# EasyEDA Pro project 第十五届蓝桥杯EDA赛模拟试题一参考答案.eprj

# Schematic Schematic1
Create Date: 2023-12-29; Page Name: P1; Project Name: 题目二：基于CW32的简易游戏机; Schematic Name: Schematic1; Update Date: 2024-01-06; Company: 深圳嘉立创科技集团股份有限公司; Drawed: 嘉立创EDA; Page Size: A4; Part Number: JLC-PCB-002; Reviewed: 嘉立创EDA; Version: V1.0
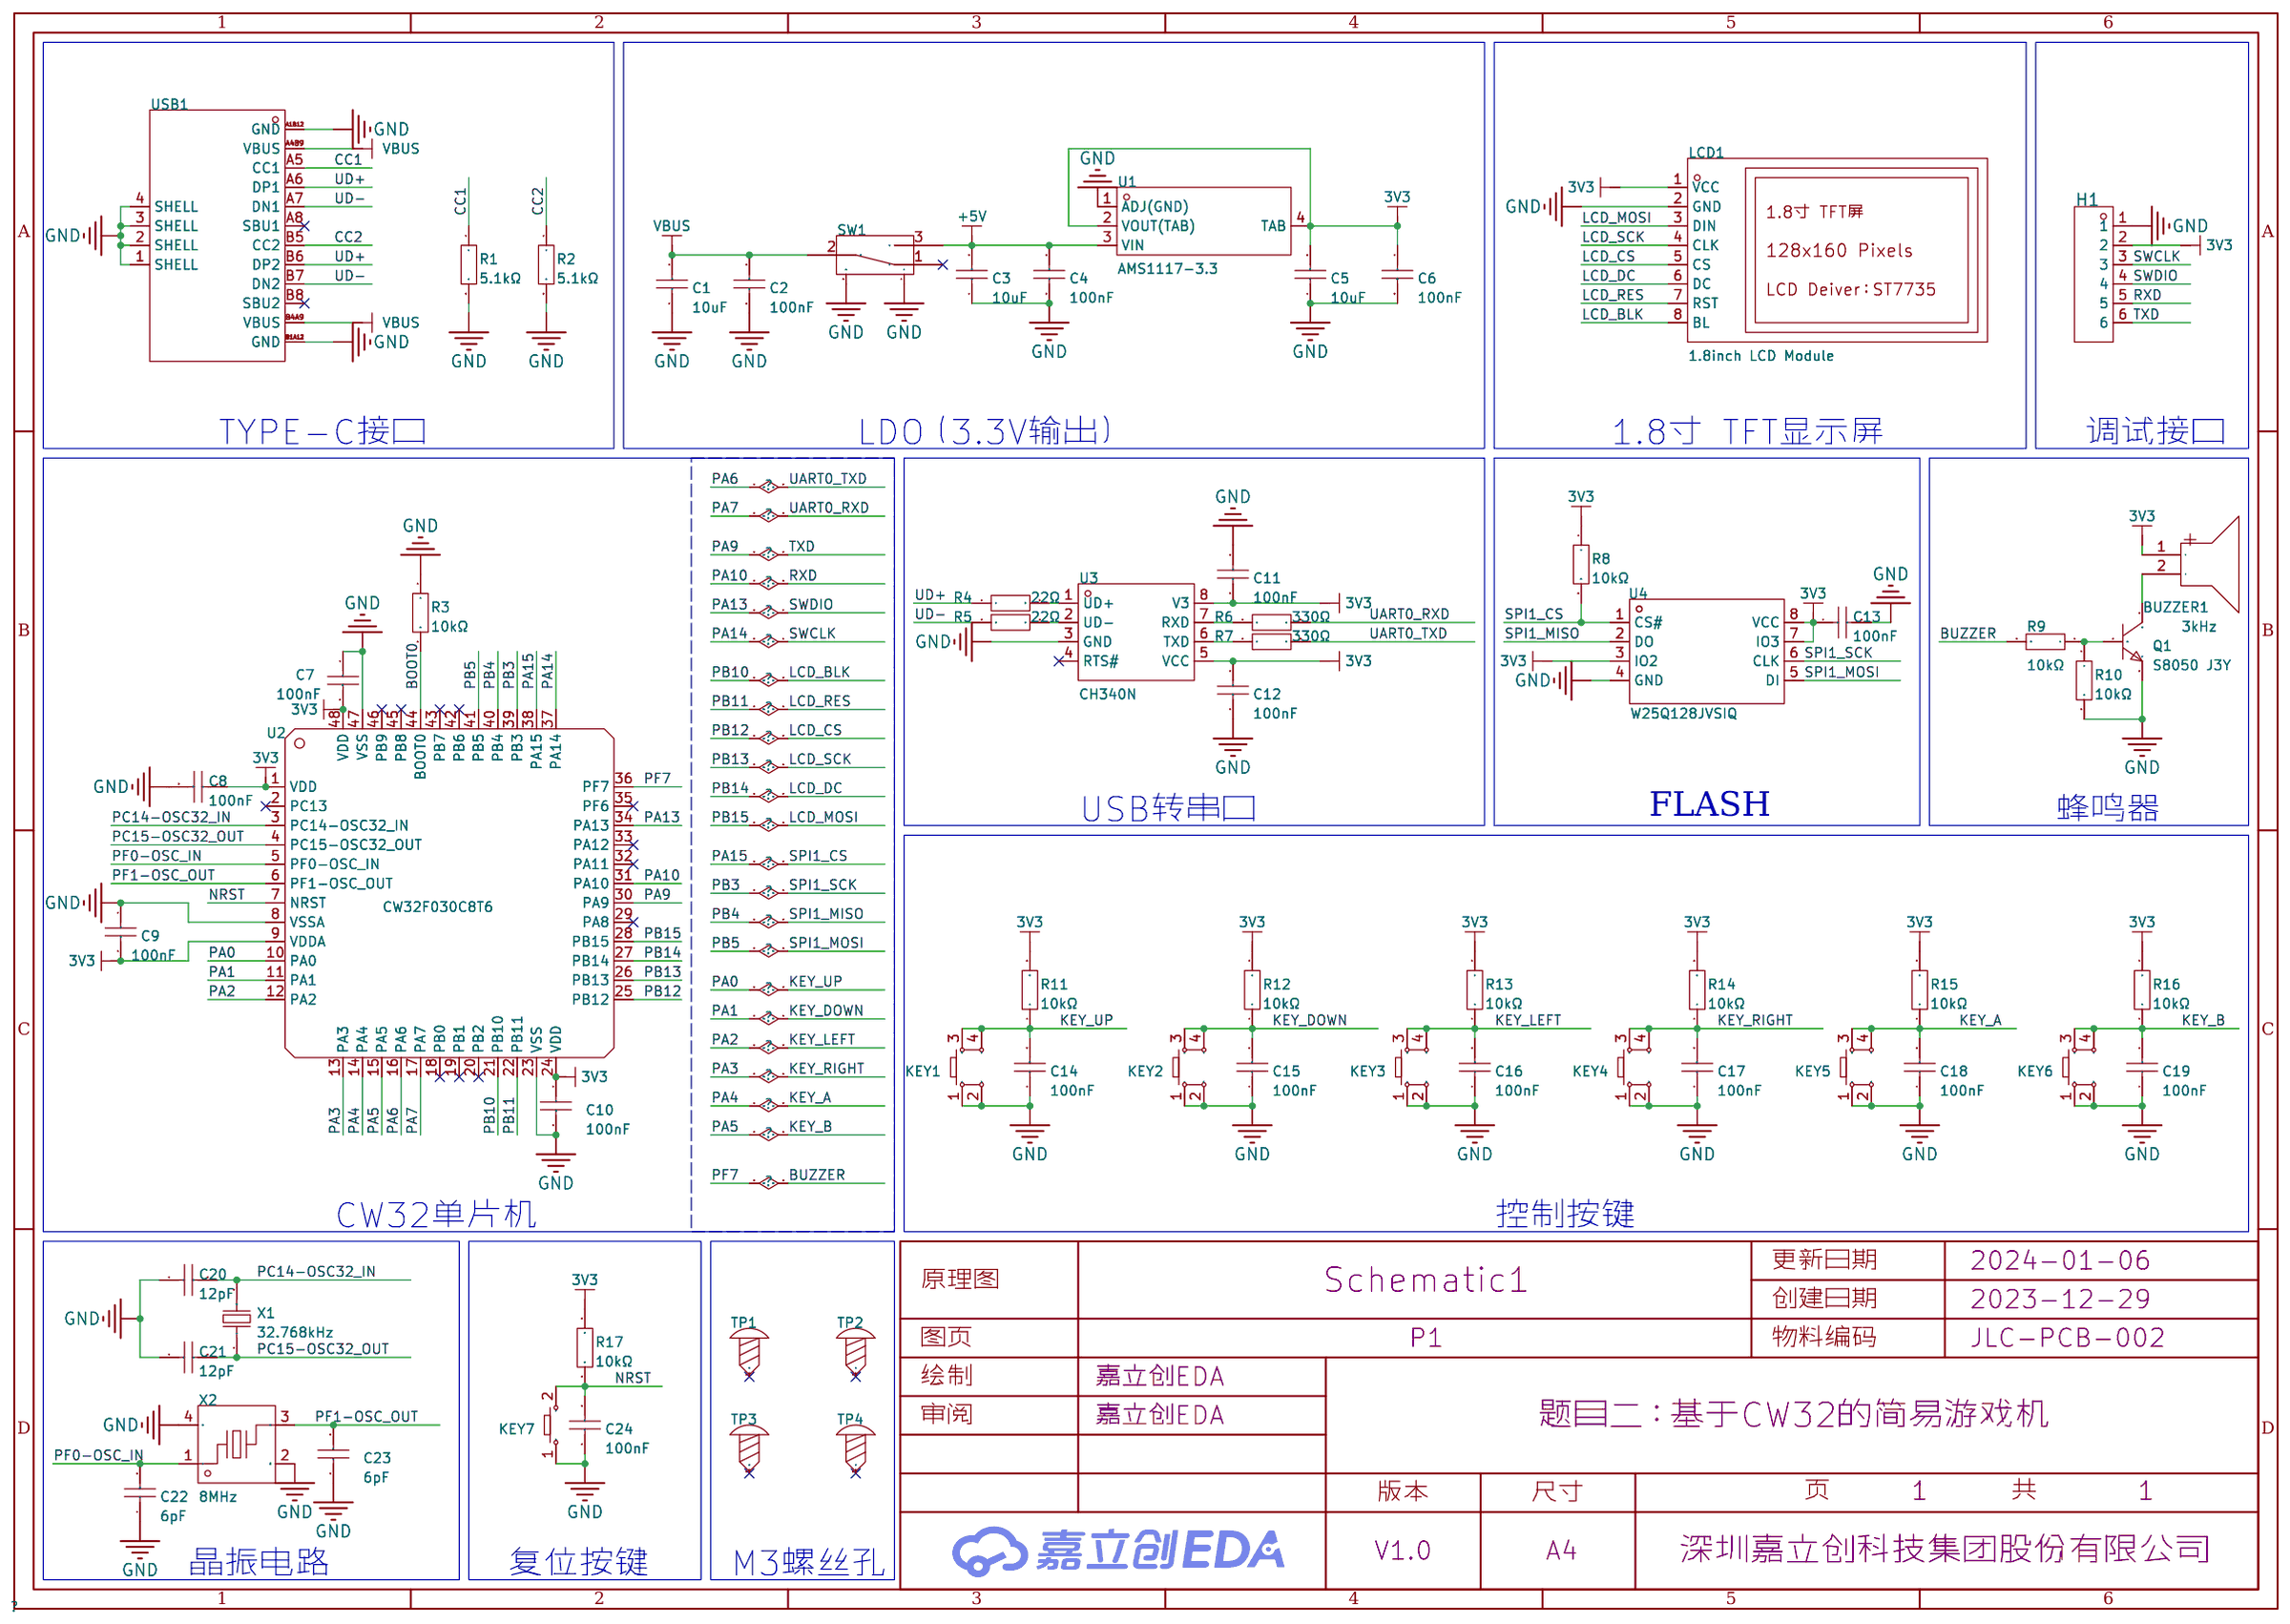
[diagram p0: schematic sheet]

## Parts
BUZZER1  3kHz  [BUZ-TH_BD9.0-P5.00-D0.6-FD]
C1  10uF  [C0805]
C2  100nF  [C0805]
C3  10uF  [C0805]
C4  100nF  [C0805]
C5  10uF  [C0805]
C6  100nF  [C0805]
C7  100nF  [C0805]
C8  100nF  [C0805]
C9  100nF  [C0805]
C10  100nF  [C0805]
C11  100nF  [C0805]
C12  100nF  [C0805]
C13  100nF  [C0805]
C14  100nF  [C0805]
C15  100nF  [C0805]
C16  100nF  [C0805]
C17  100nF  [C0805]
C18  100nF  [C0805]
C19  100nF  [C0805]
C20  12pF  [C0805]
C21  12pF  [C0805]
C22  6pF  [C0805]
C23  6pF  [C0805]
C24  100nF  [C0805]
H1  PZ254V-11-06P  [HDR-TH_6P-P2.54-V-M]
KEY1  -  [SW-SMD_4P-L6.0-W6.0-P4.50-LS9.0-2]
KEY2  -  [SW-SMD_4P-L6.0-W6.0-P4.50-LS9.0-2]
KEY3  -  [SW-SMD_4P-L6.0-W6.0-P4.50-LS9.0-2]
KEY4  -  [SW-SMD_4P-L6.0-W6.0-P4.50-LS9.0-2]
KEY5  -  [SW-SMD_4P-L6.0-W6.0-P4.50-LS9.0-2]
KEY6  -  [SW-SMD_4P-L6.0-W6.0-P4.50-LS9.0-2]
KEY7  -  [Key_SMD_3.6x6.1x2.5]
LCD1  1.8inch LCD Module  [LCD-TH_L56.5-W34.0_1-8INCH-LCD-MODULE]
Q1  S8050 J3Y  [SOT-23-3_L3.0-W1.7-P0.95-LS2.9-BR]
R1  5.1kΩ  [R0805]
R2  5.1kΩ  [R0805]
R3  10kΩ  [R0805]
R4  22Ω  [R0805]
R5  22Ω  [R0805]
R6  330Ω  [R0805]
R7  330Ω  [R0805]
R8  10kΩ  [R0805]
R9  10kΩ  [R0805]
R10  10kΩ  [R0805]
R11  10kΩ  [R0805]
R12  10kΩ  [R0805]
R13  10kΩ  [R0805]
R14  10kΩ  [R0805]
R15  10kΩ  [R0805]
R16  10kΩ  [R0805]
R17  10kΩ  [R0805]
SW1  SK-12E12-G5  [SW-TH_SK-12E12-G5]
TP1  -  [M3螺丝]
TP2  -  [M3螺丝]
TP3  -  [M3螺丝]
TP4  -  [M3螺丝]
U1  AMS1117-3.3  [SOT-223-4_L6.5-W3.5-P2.30-LS7.0-BR]
U2  CW32F030C8T6  [LQFP-48_L7.0-W7.0-P0.50-LS9.0-TL]
U3  CH340N  [SOP-8_L4.9-W3.9-P1.27-LS6.0-BL]
U4  W25Q128JVSIQ  [SOIC-8_L5.3-W5.3-P1.27-LS8.0-BL]
USB1  TYPE-C 16PIN 3MD(385)  [USB-C-SMD_TYPE-C16PIN]
X1  32.768kHz  [FC-135R_L3.2-W1.5]
X2  8MHz  [OSC-SMD_4P-L3.2-W2.5-BL]

## Library data of the parts
BUZZER1 = HNB09A03: 驱动方式:有源(内含驱动线路);构造类型:电磁式;额定电压:3V;工作电压:1.5V~4.5V;消耗电流:30mA;频率:3kHz;声压(SPL):85dB@10cm;直径(φD):9mm;长度:-;宽度:-;高度:5.5mm;工作温度:-20℃~+70℃;; LCSC Part Name: 电磁式有源一体蜂鸣器HNB09A03; Supplier Part: C96102; Manufacturer: 华能; Supplier Footprint: 插件,D=9mm; Datasheet: https://atta.szlcsc.com/upload/public/pdf/source/20170522/1495448326172.pdf; Supplier: LCSC; Oscillator Circuit: 有源(内含驱动线路); Technology Type: 电磁式; Rated Voltage: 3V; Operating Voltage: 1.5V~4.5V; Current Consumption: 30mA; Sound Pressure Level (SPL): 85dB@10cm; Diameter (φD): 9mm; Height: 5.5mm; Operating Temperature: -20℃~+70℃
C1 C3 C5 = CL21A106KAYNNNE_C15850: 容值:10uF;精度:±10%;额定电压:25V;材质(温度系数):X5R;; LCSC Part Name: 10uF ±10% 25V; Supplier Part: C15850; Manufacturer: SAMSUNG(三星); Manufacturer Part: CL21A106KAYNNNE; Supplier Footprint: 0805; Datasheet: https://atta.szlcsc.com/upload/public/pdf/source/20160103/1457707679302.pdf; Supplier: LCSC; Tolerance: ±10%; Voltage Rated: 25V; Temperature Coefficient: X5R
C2 C4 C6-C19 C24 = CL21B104KBCNNNC: 容值:100nF;精度:±10%;额定电压:50V;材质(温度系数):X7R;; LCSC Part Name: 100nF ±10% 50V; Supplier Part: C1711; Manufacturer: SAMSUNG(三星); Supplier Footprint: 0805; Datasheet: https://atta.szlcsc.com/upload/public/pdf/source/20160218/1457707763339.pdf; Supplier: LCSC; Tolerance: ±10%; Voltage Rated: 50V; Temperature Coefficient: X7R
C20 C21 = 0805CG120J500NT: 容值:12pF;精度:±5%;额定电压:50V;材质(温度系数):C0G;; LCSC Part Name: 12pF ±5% 50V; Supplier Part: C1792; Manufacturer: FH(风华); Supplier Footprint: 0805; Datasheet: https://atta.szlcsc.com/upload/public/pdf/source/20200305/C486355_26A10D38EF8C2A5C37091D0039909270.pdf; Supplier: LCSC; Tolerance: ±5%; Voltage Rated: 50V; Temperature Coefficient: C0G
C22 C23 = 0805CG6R0C500NT: 容值:6pF;额定电压:50V;材质(温度系数):C0G;; LCSC Part Name: 6pF 50V ±0.25pF; Supplier Part: C67560; Manufacturer: FH(风华); Supplier Footprint: 0805; JLCPCB Part Class: 扩展库; Datasheet: https://atta.szlcsc.com/upload/public/pdf/source/20200305/C486355_26A10D38EF8C2A5C37091D0039909270.pdf; Supplier: LCSC; Voltage Rated: 50V; Temperature Coefficient: C0G
H1 = PZ254V-11-06P: 排数:单排;总PIN位数:6;间距:2.54mm;插针结构:1x6P;行距:-;安装类型:直插;圆针/方针:方针;额定电流:-;额定电压:-;配合针长度:6mm;塑高:2.5mm;端接针长度:3mm;触头材质:黄铜;触头镀层:-;工作温度范围:-40℃~+105℃;颜色:黑色;; LCSC Part Name: 2.54mm 1x6P 直插 方针; Supplier Part: C492405; Manufacturer: XFCN(兴飞); Supplier Footprint: 直插,P=2.54mm; JLCPCB Part Class: 扩展库; Supplier: LCSC; Number of Rows: 单排; Number of Pins: 6; Pitch: 2.54mm; Pin Structure: 1x6P; Mounting Type: 直插; Circluar Pins/Square Pins: 方针; Length of Mating Pin: 6mm; Insulation Height: 2.5mm; Length of End Connection Pin: 3mm; Contact Material: 黄铜; Operating Temperature Range: -40℃~+105℃; Color: 黑色
KEY1-KEY6 = Key_SMD_6x6x6.5: Supplier Footprint: SMD
KEY7 = Key_SMD_3.6x6.1x2.5: Supplier Footprint: SMD
LCD1 = 1.8inch LCD Module: 主控芯片:ST7735S;尺寸(inch):1.8;; LCSC Part Name: 树莓派 1.8寸LCD 迷你显示屏 扩展板 SPI接口 支持Arduino; Supplier Part: C359940; Manufacturer: Waveshare(微雪电子); Datasheet: https://atta.szlcsc.com/upload/public/pdf/source/20190107/C359940_B08D95A5D16FFF3D67403C4EC320696B.pdf; Supplier: LCSC; Main Control Chip: ST7735S; Size: 1.8
Q1 = S8050 J3Y_C2146: 晶体管类型:NPN;集射极击穿电压(Vceo):25V;集电极电流(Ic):500mA;功率(Pd):300mW;直流电流增益(hFE@Ic,Vce):200@50mA,1V;; LCSC Part Name: NPN 25V 500mA (200-350); Supplier Part: C2146; Manufacturer: CJ(江苏长电/长晶); Supplier Footprint: SOT-23; Datasheet: https://atta.szlcsc.com/upload/public/pdf/source/20140809/1457707209234.pdf; Supplier: LCSC; Transistor Type: NPN; Collector-Emitter Breakdown Voltage (Vceo): 25V; Collector Current (Ic): 500mA; Power Dissipation (Pd): 300mW; Collector Cut-Off Current (Icbo): 100nA; Collector-Emitter Saturation Voltage (VCE(sat)@Ic,Ib): 600mV@500mA,50mA; DC Current Gain (hFE@Ic,Vce): 200@50mA,1V; Transition Frequency (fT): 150MHz; Operating Temperature: +150℃@(Tj)
R1 R2 = 0805W8F5101T5E: 阻值:5.1kΩ;精度:±1%;功率:125mW;温度系数:±100ppm/℃;电阻类型:厚膜电阻;; LCSC Part Name: 5.1kΩ ±1% 125mW 厚膜电阻; Supplier Part: C27834; Manufacturer: UNI-ROYAL(厚声); Supplier Footprint: 0805; JLCPCB Part Class: 基础库; Datasheet: https://atta.szlcsc.com/upload/public/pdf/source/20200306/C422600_1E6D84923E4A46A82E41ADD87F860B5C.pdf; Supplier: LCSC; Tolerance: ±1%; Power(Watts): 125mW; Overload Voltage (Max): 150V; Temperature Coefficient: ±100ppm/℃; Type: 厚膜电阻; Operating Temperature Range: -55℃~+155℃
R3 R8-R17 = 0805W8F1002T5E_C17414: 阻值:10kΩ;精度:±1%;功率:125mW;温度系数:±100ppm/℃;电阻类型:厚膜电阻;; LCSC Part Name: 10kΩ ±1% 125mW 厚膜电阻; Supplier Part: C17414; Manufacturer: UNI-ROYAL(厚声); Manufacturer Part: 0805W8F1002T5E; Supplier Footprint: 0805; Datasheet: https://atta.szlcsc.com/upload/public/pdf/source/20200306/C422600_1E6D84923E4A46A82E41ADD87F860B5C.pdf; Supplier: LCSC; Tolerance: ±1%; Power(Watts): 125mW; Overload Voltage (Max): 150V; Temperature Coefficient: ±100ppm/℃; Type: 厚膜电阻; Operating Temperature Range: -55℃~+155℃
R4 R5 = 0805W8F220JT5E: 阻值:22Ω;精度:±1%;功率:125mW;温度系数:±100ppm/℃;电阻类型:厚膜电阻;; LCSC Part Name: 22Ω ±1% 125mW 厚膜电阻; Supplier Part: C17561; Manufacturer: UNI-ROYAL(厚声); Supplier Footprint: 0805; JLCPCB Part Class: 基础库; Datasheet: https://atta.szlcsc.com/upload/public/pdf/source/20200306/C422600_1E6D84923E4A46A82E41ADD87F860B5C.pdf; Supplier: LCSC; Tolerance: ±1%; Power(Watts): 125mW; Overload Voltage (Max): 150V; Temperature Coefficient: ±100ppm/℃; Type: 厚膜电阻; Operating Temperature Range: -55℃~+155℃
R6 R7 = 0805W8F3300T5E: 阻值:330Ω;精度:±1%;功率:125mW;温度系数:±100ppm/℃;电阻类型:厚膜电阻;; LCSC Part Name: 330Ω ±1% 125mW 厚膜电阻; Supplier Part: C17630; Manufacturer: UNI-ROYAL(厚声); Supplier Footprint: 0805; JLCPCB Part Class: 基础库; Datasheet: https://atta.szlcsc.com/upload/public/pdf/source/20200306/C422600_1E6D84923E4A46A82E41ADD87F860B5C.pdf; Supplier: LCSC; Tolerance: ±1%; Power(Watts): 125mW; Overload Voltage (Max): 150V; Temperature Coefficient: ±100ppm/℃; Type: 厚膜电阻; Operating Temperature Range: -55℃~+155℃
SW1 = SK-12E12-G5: 额定电流(DC):-;额定电压(DC):-;额定电流(AC):-;额定电压(AC):-;电路结构:单刀双掷;安装方式:卧插;机械寿命:5千次;; LCSC Part Name: 卧插双档 滑动开关; Supplier Part: C136720; Manufacturer: 韩国韩荣; Supplier Footprint: 插件; JLCPCB Part Class: 扩展库; Datasheet: https://atta.szlcsc.com/upload/public/pdf/source/20210810/880D64C2F8CCE477762EFCC00B7B7681.pdf; Supplier: LCSC; Circuit: 单刀双掷; Mounting Style: 卧插; Mechanical Life: 5千次; Actuator Style: 矩形柱状; Pin Style: PC引脚; Operating Temperature: -25℃~+70℃; Switch Height: 10.6mm
TP1-TP4 = M3螺丝: Supplier Footprint: 插件
U1 = AMS1117-3.3_C347222: 输出类型:固定;最大输入电压:18V;输出电压:3.3V;输出电流:1A;电源纹波抑制比(PSRR):60dB@(120Hz);输出极性:正;; LCSC Part Name: 输入18V 输出3.3V 1A; Supplier Part: C347222; Manufacturer: UMW(友台半导体); Supplier Footprint: SOT-223; JLCPCB Part Class: 扩展库; Datasheet: https://atta.szlcsc.com/upload/public/pdf/source/20231109/155D79A26D9DB04352555A58D5969DC8.pdf; Supplier: LCSC; Output Type: 固定; Maximum Input Voltage: 18V; Output Voltage: 3.3V; Output Current: 1A; Power Supply Rejection Ratio (PSRR): 60dB@(120Hz); Dropout Voltage: 1.3V@(1A); Output Polarity: 正; Number of Outputs: 1
U2 = CW32F030C8T6_C3019113: CPU内核:ARM-M系列;CPU最大主频:64MHz;程序存储容量:-;程序存储器类型:-;GPIO端口数量:39;工作电压范围:1.65V~5.5V;RAM总容量:8KB;; Supplier Part: C3019113; Manufacturer: CW(芯源); Supplier Footprint: LQFP-48(7x7); Datasheet: https://atta.szlcsc.com/upload/public/pdf/source/20220516/D60F5E1023A73FFF550D4A77416DDFBC.pdf; Supplier: LCSC; CPU Core: ARM-M系列; CPU Maximum Speed: 64MHz; GPIO Ports Number: 39; Operating Voltage Range: 1.65V~5.5V; RAM Size: 8KB; Operating Temperature Range: -40℃~+105℃; ADC (Bit): 12bit; 16Bit Timer: 8; UART/USART: 3; I2C: 2; SPI: 2; Internal Comparator: 有; Peripheral/Function: 片载温度传感器；DMA；看门狗；低电压检测；CRC校验; Watchdog: 有; Low-Voltage Detect: 有; Direct Memory Access: 有
U3 = CH340N: LCSC Part Name: USB转串口芯片 CH340; Supplier Part: C2977777; Manufacturer: WCH(南京沁恒); Supplier Footprint: SOP-8; JLCPCB Part Class: 扩展库; Datasheet: https://atta.szlcsc.com/upload/public/pdf/source/20230530/6E401E9554E9F5311886CC8B3F89B62E.pdf; Supplier: LCSC
U4 = W25Q128JVSIQ: 接口类型:-;存储容量:128Mbit;时钟频率(fc):-;; LCSC Part Name: W25Q128JVSIQ 编带; Supplier Part: C97521; Manufacturer: WINBOND(华邦); Supplier Footprint: SOP-8-208mil; JLCPCB Part Class: 基础库; Datasheet: https://atta.szlcsc.com/upload/public/pdf/source/20170316/1489627409956.pdf; Supplier: LCSC; Memory Size: 128Mbit
USB1 = TYPE-C 16PIN 3MD(385): 连接器类型:Type-C;标准:-;公母:母;端口数量:1;触点数量:16P;安装方式:卧贴;额定电流 - 电源:3A;工作温度范围:-40℃~+85℃;; LCSC Part Name: Type-C 母 卧贴; Supplier Part: C2858270; Manufacturer: SHOU HAN(首韩); Supplier Footprint: SMD; JLCPCB Part Class: Extended Part; Datasheet: https://atta.szlcsc.com/upload/public/pdf/source/20211123/39B17C16241EAC15C5E277BDA434118E.pdf; Supplier: LCSC; Connector Type: Type-C; Gender: 母; Number of Ports: 1; Number of Contacts: 16P; Mounting Style: 卧贴; Current Rating - Power (Max): 3A; Operating Temperature Range: -40℃~+85℃
X1 = Q13FC1350000400: 频率:32.768kHz;负载电容:12.5pF;频率公差:±20ppm;; LCSC Part Name: 32.768kHz ±20ppm 12.5pF; Supplier Part: C32346; Manufacturer: EPSON(爱普生); Supplier Footprint: SMD3215-2P; Datasheet: https://atta.szlcsc.com/upload/public/pdf/source/20190108/C32346_746D6B07EAF90824457A96480007685F.pdf; Supplier: LCSC; Crystal Type: 贴片无源晶振; Load Capacitance: 12.5pF; Equivalent Series Resistance (ESR): 70kΩ; Frequency Tolerance: ±20ppm; Operating Temperature: -40℃~+85℃
X2 = X32258MOB4SI: 晶振类型:贴片无源晶振;频率:8MHz;常温频差:±10ppm;负载电容:12pF;频率稳定度(全温):±30ppm;; LCSC Part Name: 8MHz ±10ppm 12pF; Supplier Part: C2682775; Manufacturer: YXC(扬兴晶振); Supplier Footprint: SMD3225-4P; JLCPCB Part Class: 扩展库; Datasheet: https://atta.szlcsc.com/upload/public/pdf/source/20210106/C2682774_0CD4FDA5D9DA3FBEEC23BD607A48E4B0.pdf; Supplier: LCSC; Crystal Type: 贴片无源晶振; Normal temperature Frequency Tolerance: ±10ppm; Load Capacitance: 12pF; Frequency Stability(Full temperature range): ±30ppm; Equivalent Series Resistance (ESR): 150Ω; Operating Temperature: -40℃~+85℃

## Nets
3V3: BUZZER1.1(+) C5.2 C6.1 C7.2 C8.1 C9.2 C10.1 C11.2 C12.1 C13.1 H1.2 LCD1.1(VCC) R8.1 R11.2 R12.2 R13.2 R14.2 R15.2 R16.2 R17.2 U1.2(VOUT(TAB)) U1.4(TAB) U2.1(VDD) U2.9(VDDA) U2.24(VDD) U2.48(VDD) U3.5(VCC) U3.8(V3) U4.3(IO2) U4.7(IO3) U4.8(VCC)
+5V: C3.2 C4.1 SW1.3 U1.3(VIN)
GND: C1.1 C2.2 C3.1 C4.2 C5.1 C6.2 C7.1 C8.2 C9.1 C10.2 C11.1 C12.2 C13.2 C14.1 C15.1 C16.1 C17.1 C18.1 C19.1 C20.1 C21.1 C22.1 C23.1 C24.1 H1.1 KEY1.1 KEY1.2 KEY2.1 KEY2.2 KEY3.1 KEY3.2 KEY4.1 KEY4.2 KEY5.1 KEY5.2 KEY6.1 KEY6.2 KEY7.1 LCD1.2(GND) Q1.2(E) R1.2 R2.2 R3.1 R10.2 SW1.4 SW1.5 U1.1(ADJ(GND)) U2.8(VSSA) U2.23(VSS) U2.47(VSS) U3.3(GND) U4.4(GND) USB1.1(SHELL) USB1.2(SHELL) USB1.3(SHELL) USB1.4(SHELL) USB1.A1B12(GND) USB1.B1A12(GND) X2.2(GND) X2.4(GND)
VBUS: C1.2 C2.1 SW1.2 USB1.A4B9(VBUS) USB1.B4A9(VBUS)
BOOT0: R3.2 U2.44(BOOT0)
BUZZER: R9.2 U2.36(PF7)
CC1: R1.1 USB1.A5(CC1)
CC2: R2.1 USB1.B5(CC2)
KEY_A: C18.2 KEY5.3 KEY5.4 R15.1 U2.14(PA4)
KEY_B: C19.2 KEY6.3 KEY6.4 R16.1 U2.15(PA5)
KEY_DOWN: C15.2 KEY2.3 KEY2.4 R12.1 U2.11(PA1)
KEY_LEFT: C16.2 KEY3.3 KEY3.4 R13.1 U2.12(PA2)
KEY_RIGHT: C17.2 KEY4.3 KEY4.4 R14.1 U2.13(PA3)
KEY_UP: C14.2 KEY1.3 KEY1.4 R11.1 U2.10(PA0)
LCD_BLK: LCD1.8(BL) U2.21(PB10)
LCD_CS: LCD1.5(CS) U2.25(PB12)
LCD_DC: LCD1.6(DC) U2.27(PB14)
LCD_MOSI: LCD1.3(DIN) U2.28(PB15)
LCD_RES: LCD1.7(RST) U2.22(PB11)
LCD_SCK: LCD1.4(CLK) U2.26(PB13)
NRST: C24.2 KEY7.2 R17.1 U2.7(NRST)
PA6: R7.2 U2.16(PA6)
PA7: R6.2 U2.17(PA7)
PA9: H1.6 U2.30(PA9)
PA10: H1.5 U2.31(PA10)
PA13: H1.4 U2.34(PA13)
PA14: H1.3 U2.37(PA14)
PA15: R8.2 U2.38(PA15) U4.1(CS#)
PB3: U2.39(PB3) U4.6(CLK)
PB4: U2.40(PB4) U4.2(DO)
PB5: U2.41(PB5) U4.5(DI)
PC14-OSC32_IN: C20.2 U2.3(PC14-OSC32_IN) X1.2
PC15-OSC32_OUT: C21.2 U2.4(PC15-OSC32_OUT) X1.1
PF0-OSC_IN: C22.2 U2.5(PF0-OSC_IN) X2.1
PF1-OSC_OUT: C23.2 U2.6(PF1-OSC_OUT) X2.3
UD+: R4.1 USB1.A6(DP1) USB1.B6(DP2)
UD-: R5.1 USB1.A7(DN1) USB1.B7(DN2)
$1N8057: Q1.1(B) R9.1 R10.1
$1N8058: BUZZER1.2(-) Q1.3(C)
$1N15380: R4.2 U3.1(UD+)
$1N15383: R5.2 U3.2(UD-)
$1N15386: R6.1 U3.7(RXD)
$1N15389: R7.1 U3.6(TXD)

Not connected (* = marked no-connect by the designer): SW1 1*; TP1 1*; TP2 1*; TP3 1*; TP4 1*; U2 2(PC13)* 18(PB0)* 19(PB1)* 20(PB2)* 29(PA8)* 32(PA11)* 33(PA12)* 35(PF6)* 42(PB6)* 43(PB7)* 45(PB8)* 46(PB9)*; U3 4(RTS#)*; USB1 A8(SBU1)* B8(SBU2)*

## Notes on the sheet
- TYPE-C接口
- LDO（3.3V输出）
- 1.8寸 TFT显示屏
- 调试接口
- USB转串口
- FLASH
- 蜂鸣器
- CW32单片机
- 控制按键
- 晶振电路
- 复位按键
- M3螺丝孔

# Board PCB1
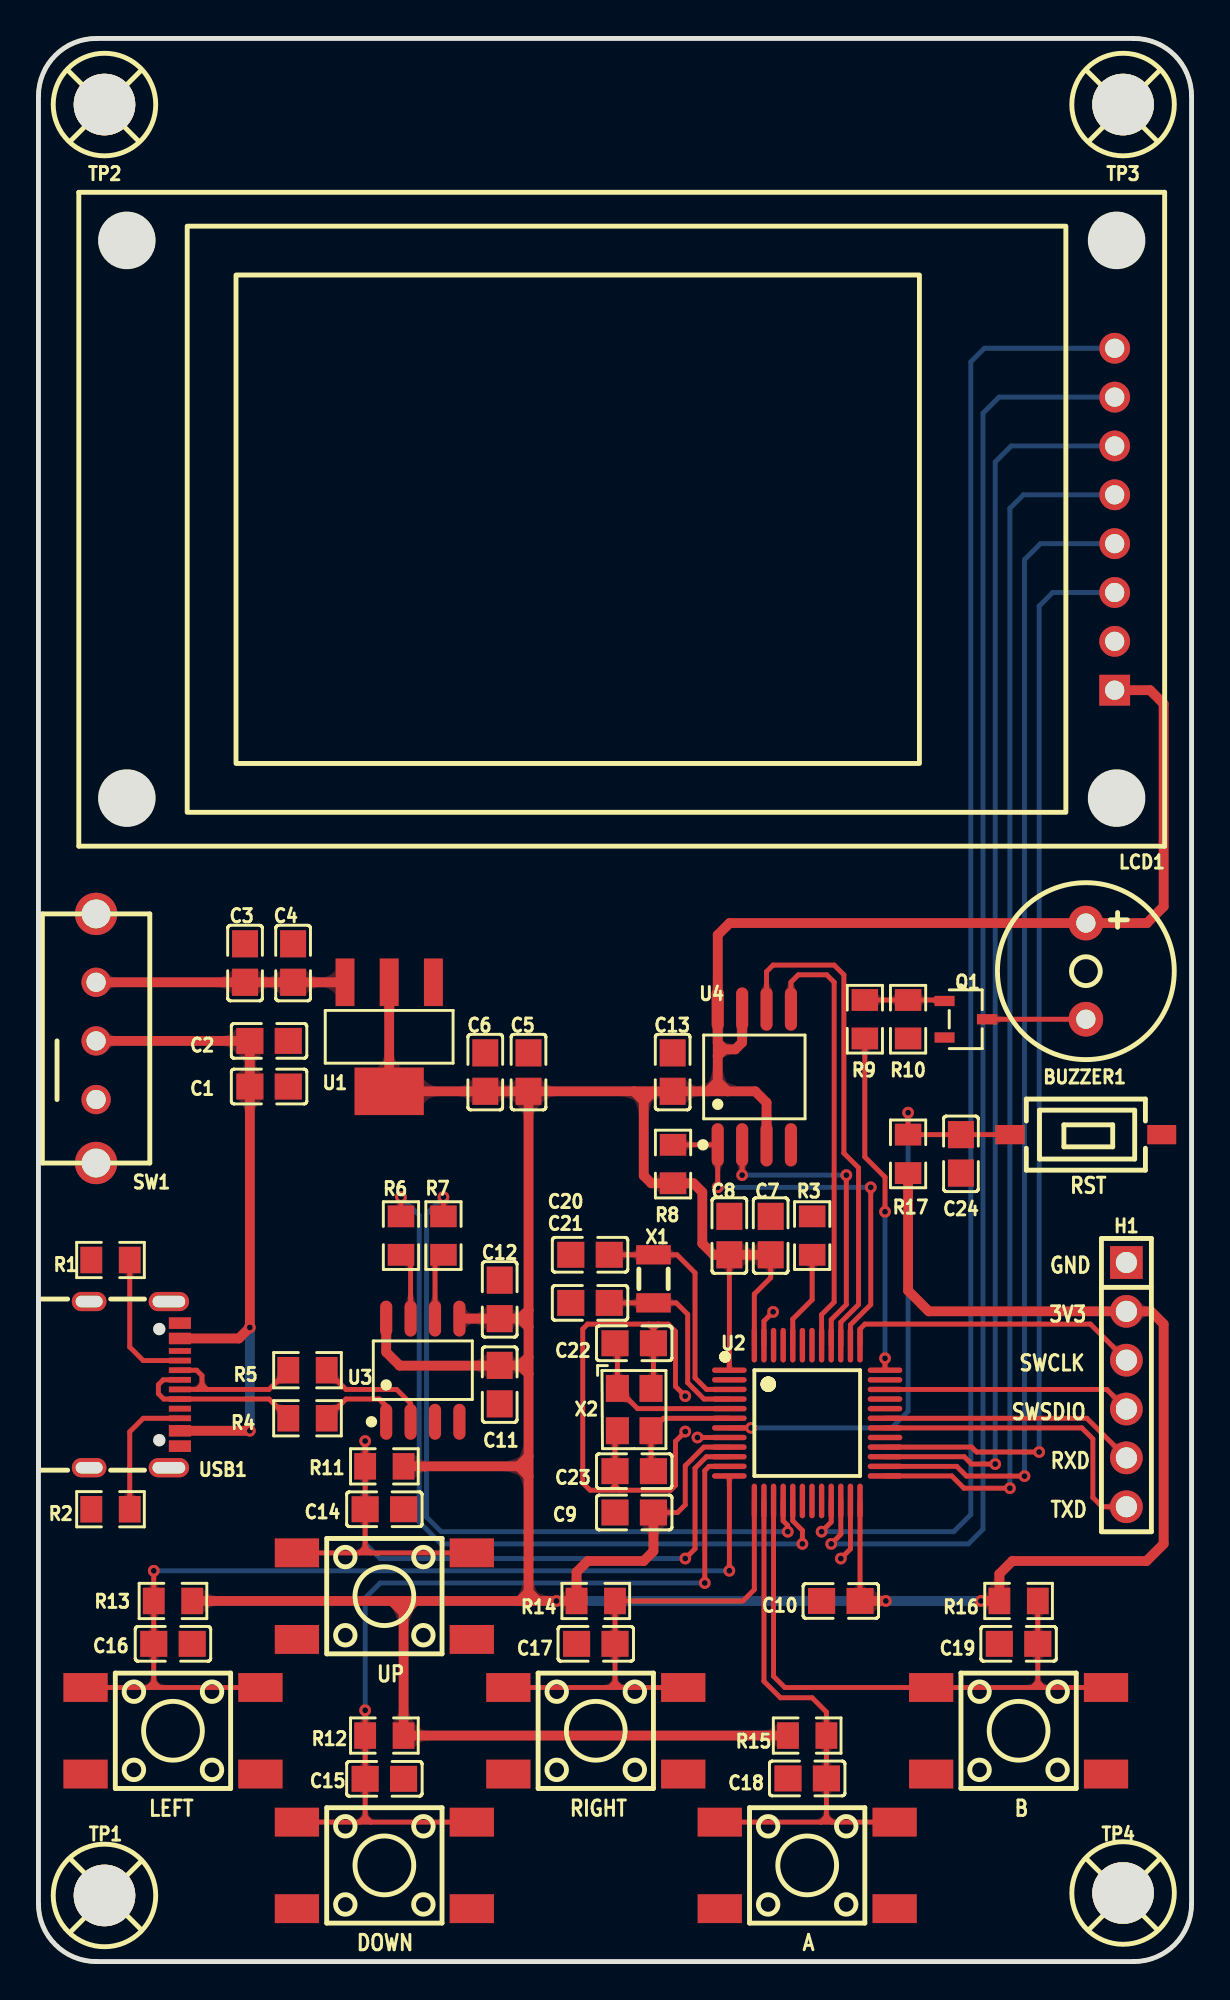
[diagram p1: board, top side]
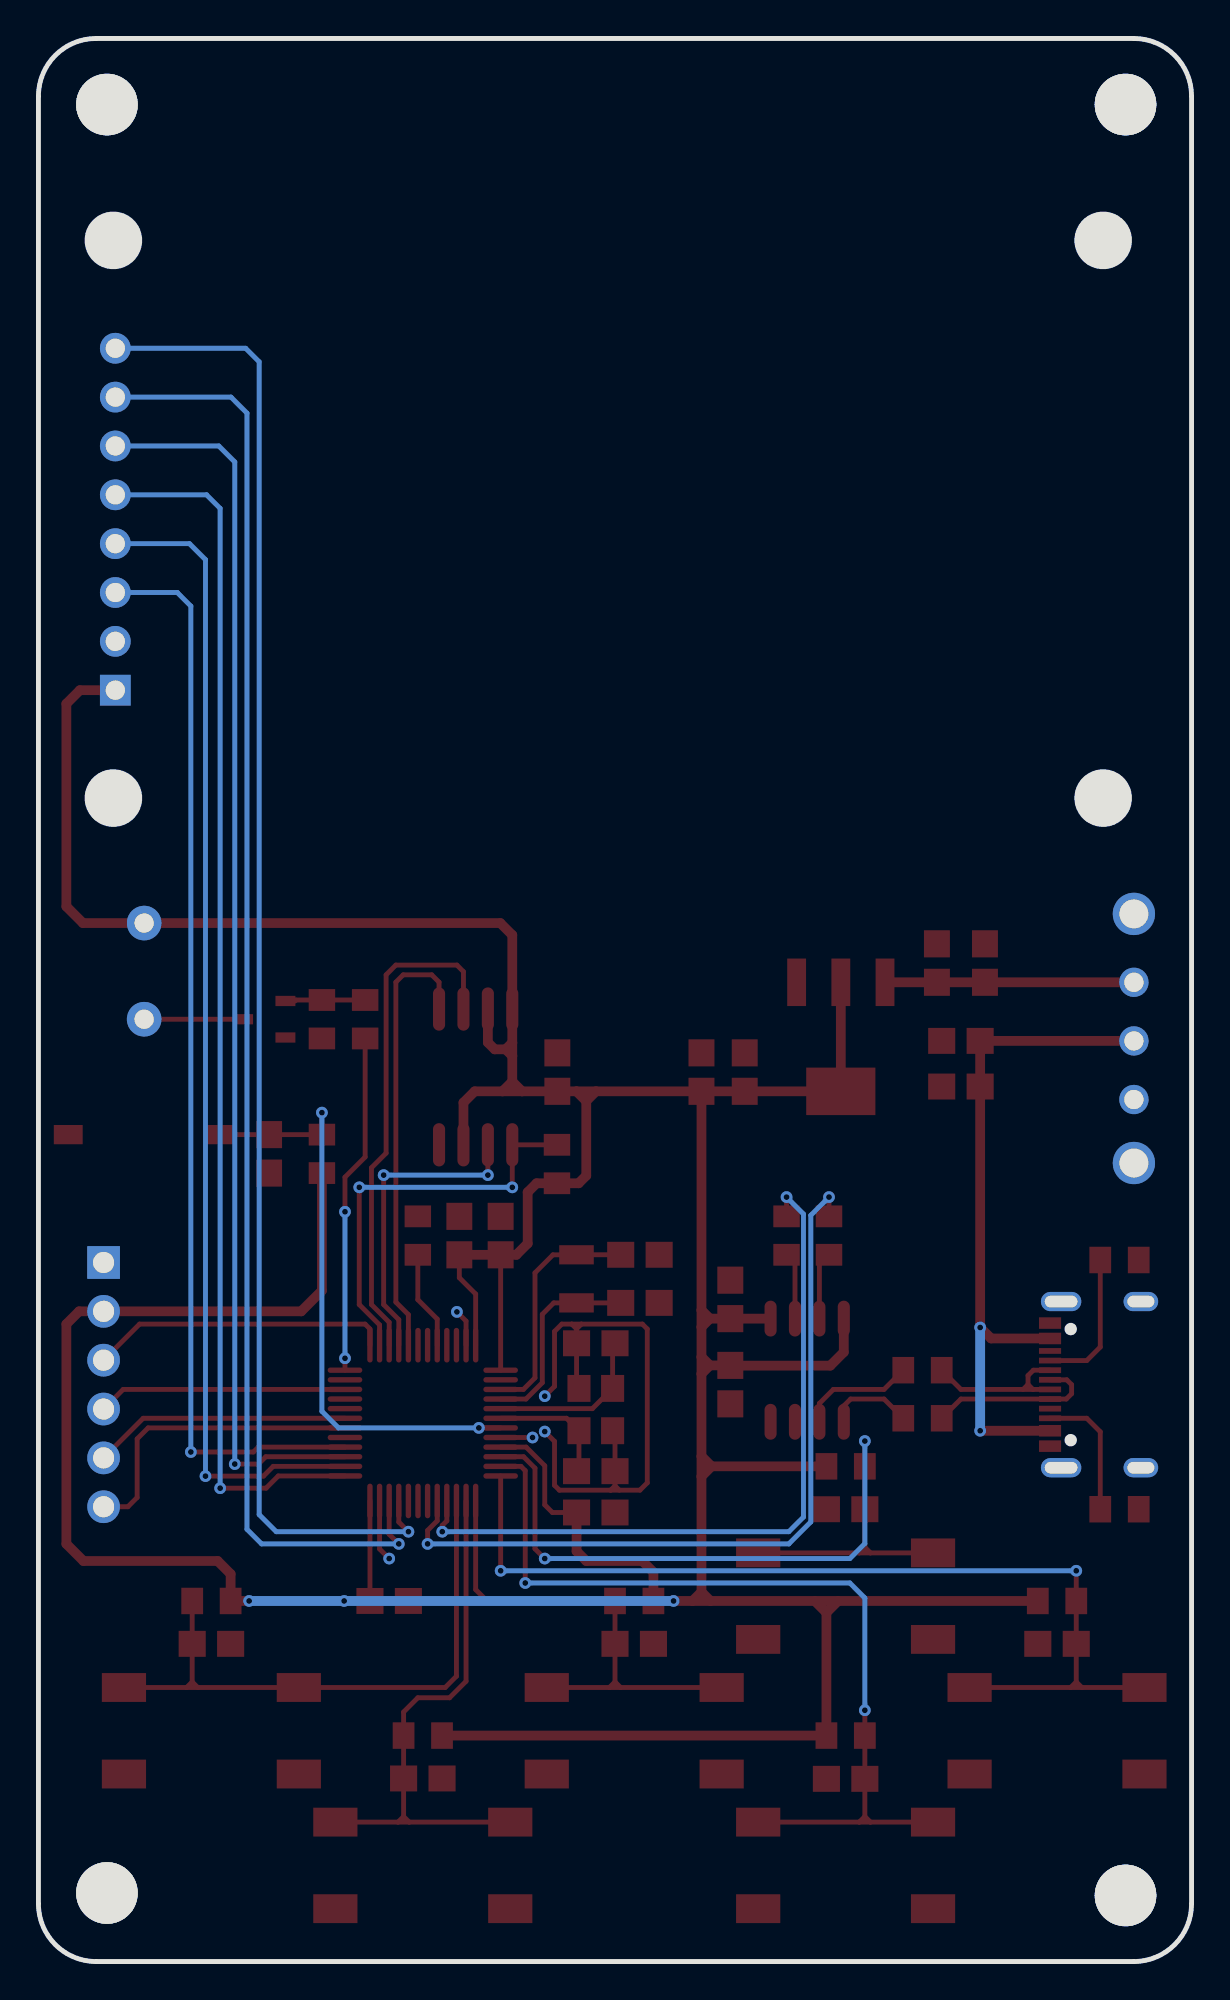
[diagram p2: board, bottom side, seen from below]

Outline 60 x 100 mm; copper layers: Top Layer, Bottom Layer. Coordinates in mm from the lower left corner of the outline.
Outline path: 0,97 0,3 arc(0.88,0.88) 3,0 57,0 arc(59.12,0.88) 60,3 60,97 arc(59.12,99.12) 57,100 3,100 arc(0.88,99.12) 0,97
Stack: Top Layer 0.035mm / Dielectric1 1.51mm FR4 er 4.5 / Bottom Layer 0.035mm

## Design rules (mm)
template: JLCPCB Capability(Two Layers Board)
spacing copperThickness1oz (default): track to track 0.102, other pairs 0.152 to 0.3
spacing copperThickness2oz: track to track 0.203, other pairs 0.152 to 0.3
track width copperThickness1oz (default): min 0.127, default 0.254, max 2.54
track width copperThickness2oz: min 0.203, default 0.254, max 2.54
differential pair differentialPair (default): width min 0.127, default 0.254, max 2.54; gap min 0.152, default 0.152
via viaSize (default): diameter min 0.5, default 0.61, max 10; hole min 0.3, default 0.305, max 6.3

## Placement (name value [footprint] x y rotation side)
BUZZER1  3kHz  [BUZ-TH_BD9.0-P5.00-D0.6-FD]  54.5 51.5 270 top
C1  10uF  [C0805]  12 45.5 180 top
C2  100nF  [C0805]  12 47.87 0 top
C3  10uF  [C0805]  10.75 51.92 270 top
C4  100nF  [C0805]  13.25 51.92 90 top
C5  10uF  [C0805]  25.5 46.25 270 top
C6  100nF  [C0805]  23.25 46.25 90 top
C7  100nF  [C0805]  38.1 37.75 270 top
C8  100nF  [C0805]  35.95 37.75 90 top
C9  100nF  [C0805]  31 23.35 0 top
C10  100nF  [C0805]  41.75 18.75 180 top
C11  100nF  [C0805]  24 30 90 top
C12  100nF  [C0805]  24 34.43 90 top
C13  100nF  [C0805]  33 46.25 90 top
C14  100nF  [C0805]  18 23.52 180 top
C15  100nF  [C0805]  18 9.5 180 top
C16  100nF  [C0805]  7 16.52 180 top
C17  100nF  [C0805]  29 16.52 0 top
C18  100nF  [C0805]  40 9.52 0 top
C19  100nF  [C0805]  51 16.52 0 top
C20  12pF  [C0805]  28.7 36.75 0 top
C21  12pF  [C0805]  28.7 34.25 0 top
C22  6pF  [C0805]  31 32.15 180 top
C23  6pF  [C0805]  31 25.5 0 top
C24  100nF  [C0805]  48 42 90 top
H1  PZ254V-11-06P  [HDR-TH_6P-P2.54-V-M]  56.61 30 270 top
KEY1  -  [SW-SMD_4P-L6.0-W6.0-P4.50-LS9.0-2]  18 19 180 top
KEY2  -  [SW-SMD_4P-L6.0-W6.0-P4.50-LS9.0-2]  18 5 180 top
KEY3  -  [SW-SMD_4P-L6.0-W6.0-P4.50-LS9.0-2]  7 12 180 top
KEY4  -  [SW-SMD_4P-L6.0-W6.0-P4.50-LS9.0-2]  29 12 180 top
KEY5  -  [SW-SMD_4P-L6.0-W6.0-P4.50-LS9.0-2]  40 5 180 top
KEY6  -  [SW-SMD_4P-L6.0-W6.0-P4.50-LS9.0-2]  51 12 180 top
KEY7  -  [Key_SMD_3.6x6.1x2.5]  54.5 43 180 top
LCD1  1.8inch LCD Module  [LCD-TH_L56.5-W34.0_1-8INCH-LCD-MODULE]  56 75 90 top
Q1  S8050 J3Y  [SOT-23-3_L3.0-W1.7-P0.95-LS2.9-BR]  48.25 49 180 top
R1  5.1kΩ  [R0805]  3.75 36.48 180 top
R2  5.1kΩ  [R0805]  3.75 23.52 180 top
R3  10kΩ  [R0805]  40.26 37.75 270 top
R4  22Ω  [R0805]  14 28.25 0 top
R5  22Ω  [R0805]  14 30.75 0 top
R6  330Ω  [R0805]  18.87 37.75 90 top
R7  330Ω  [R0805]  21.07 37.75 90 top
R8  10kΩ  [R0805]  33.02 41.47 90 top
R9  10kΩ  [R0805]  43 49 270 top
R10  10kΩ  [R0805]  45.25 49 270 top
R11  10kΩ  [R0805]  18 25.75 0 top
R12  10kΩ  [R0805]  18 11.75 0 top
R13  10kΩ  [R0805]  7 18.75 0 top
R14  10kΩ  [R0805]  29 18.75 180 top
R15  10kΩ  [R0805]  40 11.75 180 top
R16  10kΩ  [R0805]  51 18.75 180 top
R17  10kΩ  [R0805]  45.25 42 270 top
SW1  SK-12E12-G5  [SW-TH_SK-12E12-G5]  3 48 180 top
TP1  -  [M3螺丝]  3.5 3.5 90 top
TP2  -  [M3螺丝]  3.5 96.5 0 top
TP3  -  [M3螺丝]  56.5 96.5 0 top
TP4  -  [M3螺丝]  56.5 3.5 0 top
U1  AMS1117-3.3  [SOT-223-4_L6.5-W3.5-P2.30-LS7.0-BR]  18.25 48.09 90 top
U2  CW32F030C8T6  [LQFP-48_L7.0-W7.0-P0.50-LS9.0-TL]  40 28 0 top
U3  CH340N  [SOP-8_L4.9-W3.9-P1.27-LS6.0-BL]  20 30.75 0 top
U4  W25Q128JVSIQ  [SOIC-8_L5.3-W5.3-P1.27-LS8.0-BL]  37.25 46 0 top
USB1  TYPE-C 16PIN 3MD(385)  [USB-C-SMD_TYPE-C16PIN]  5 30 270 top
X1  32.768kHz  [FC-135R_L3.2-W1.5]  32 35.5 90 top
X2  8MHz  [OSC-SMD_4P-L3.2-W2.5-BL]  31 28.7 270 top

## Footprints (pads in the part's own frame, mm; a bottom-side part is the same pattern mirrored in y, then rotated)
BUZ-TH_BD9.0-P5.00-D0.6-FD
  round 1.8 hole 1: 1(-2.5,0) 2(2.5,0)
C0805
  rect 1.41x1.35 smd: 1(-1,0) 2(1,0)
FC-135R_L3.2-W1.5
  rect 1x1.8 smd: 1(-1.25,0) 2(1.25,0)
HDR-TH_6P-P2.54-V-M
  rect 1.7x1.7 hole 1.1: 1(-6.35,0)
  round 1.7 hole 1.1: 2(-3.81,0) 3(-1.27,0) 4(1.27,0) 5(3.81,0) 6(6.35,0)
Key_SMD_3.6x6.1x2.5
  rect 1.501x1.001 smd: 1(-3.95,0) 2(3.95,0)
LCD-TH_L56.5-W34.0_1-8INCH-LCD-MODULE
  rect 1.6x1.6 hole 1: 1(-8.89,0)
  round 1.6 hole 1: 2(-6.35,0) 3(-3.81,0) 4(-1.27,0) 5(1.27,0) 6(3.81,0) 7(6.35,0) 8(8.89,0)
LQFP-48_L7.0-W7.0-P0.50-LS9.0-TL
  oval 1.8x0.28 smd: 1(-4.05,2.75) 2(-4.05,2.25) 3(-4.05,1.75) 4(-4.05,1.25) 5(-4.05,0.75) 6(-4.05,0.25) 7(-4.05,-0.25) 8(-4.05,-0.75) 9(-4.05,-1.25) 10(-4.05,-1.75) 11(-4.05,-2.25) 12(-4.05,-2.75) 25(4.05,-2.75) 26(4.05,-2.25) 27(4.05,-1.75) 28(4.05,-1.25) 29(4.05,-0.75) 30(4.05,-0.25) 31(4.05,0.25) 32(4.05,0.75) 33(4.05,1.25) 34(4.05,1.75) 35(4.05,2.25) 36(4.05,2.75)
  oval 0.28x1.8 smd: 13(-2.75,-4.05) 14(-2.25,-4.05) 15(-1.75,-4.05) 16(-1.25,-4.05) 17(-0.75,-4.05) 18(-0.25,-4.05) 19(0.25,-4.05) 20(0.75,-4.05) 21(1.25,-4.05) 22(1.75,-4.05) 23(2.25,-4.05) 24(2.75,-4.05) 37(2.75,4.05) 38(2.25,4.05) 39(1.75,4.05) 40(1.25,4.05) 41(0.75,4.05) 42(0.25,4.05) 43(-0.25,4.05) 44(-0.75,4.05) 45(-1.25,4.05) 46(-1.75,4.05) 47(-2.25,4.05) 48(-2.75,4.05)
M3螺丝
  round 3.2 hole 3.2: 1(-0.064,0.064)
OSC-SMD_4P-L3.2-W2.5-BL
  rect 1.4x1.2 smd: 1(-1.1,-0.875) 2(1.1,-0.875) 3(1.1,0.875) 4(-1.1,0.875)
R0805
  rect 1.133x1.377 smd: 1(-1,0) 2(1,0)
SOIC-8_L5.3-W5.3-P1.27-LS8.0-BL
  oval 0.63x2.25 smd: 1(-1.905,-3.53) 2(-0.635,-3.53) 3(0.635,-3.53) 4(1.905,-3.53) 5(1.905,3.53) 6(0.635,3.53) 7(-0.635,3.53) 8(-1.905,3.53)
SOP-8_L4.9-W3.9-P1.27-LS6.0-BL
  oval 0.63x1.865 smd: 1(-1.905,-2.683) 2(-0.635,-2.683) 3(0.635,-2.683) 4(1.905,-2.683) 5(1.905,2.683) 6(0.635,2.683) 7(-0.635,2.683) 8(-1.905,2.683)
SOT-23-3_L3.0-W1.7-P0.95-LS2.9-BR
  rect 1.038x0.532 smd: 1(1.101,-0.95) 2(1.101,0.95) 3(-1.101,0)
SOT-223-4_L6.5-W3.5-P2.30-LS7.0-BR
  rect 2.47x0.98 smd: 1(2.835,-2.3) 2(2.835,0) 3(2.835,2.3)
  rect 2.47x3.6 smd: 4(-2.835,0)
SW-SMD_4P-L6.0-W6.0-P4.50-LS9.0-2
  rect 2.3x1.5 smd: 1(-4.55,2.25) 2(4.55,2.25) 3(-4.55,-2.25) 4(4.55,-2.25)
SW-TH_SK-12E12-G5
  round 1.524 hole 1: 1(0,3.175) 2(0,0.127) 3(0,-2.921)
  round 2.2 hole 1.5: 4(0,-6.477) 5(0,6.477)
USB-C-SMD_TYPE-C16PIN
  oval 1x2.1 hole 0.6x1.7: 1(-4.32,1.788) 2(4.32,1.788)
  oval 1x1.8 hole 0.6x1.4: 3(-4.32,-2.362) 4(4.32,-2.362)
  rect 0.6x1.15 smd: A1B12(-3.2,2.362) A4B9(-2.4,2.362) B1A12(3.2,2.362) B4A9(2.4,2.362)
  rect 0.3x1.15 smd: A5(-1.25,2.362) A6(-0.25,2.362) A7(0.25,2.362) A8(-1.75,2.362) B5(1.75,2.362) B6(0.75,2.362) B7(-0.75,2.362) B8(1.25,2.362)

## Nets
As in the schematic.

Pads without a net: SW1 1; TP1 1; TP2 1; TP3 1; TP4 1; U2 2 18 19 20 29 32 33 35 42 43 45 46; U3 4; USB1 A8 B8

## Via types
v1: diameter 0.61, hole 0.305, Top Layer to Bottom Layer, 34 vias

## Routing (per net, layer and track width the routed paths; a pad name or vN(x,y) marks a point on that pad's centre or on a via; arc(x,y) is an arc through that point)
3V3: length 287.8
  Top Layer w0.254: C7.2 38.1,35.56 37.25,34.71 U2.48 ; U2.1 C8.1 ; U2.24 C10.1 ; U2.9 34.62,26.75 33.66,25.78 33.66,23.75 33.26,23.35 C9.2
  Top Layer w0.508: LCD1.1 57.84,66.11 58.55,65.41 58.55,54.86 57.68,54 BUZZER1.1 35.97,54 35.34,53.38 U4.8 35.34,47.78 ; U3.8 18.09,31.69 18.8,30.99 23.99,30.99 C11.2 25.06,31 ; 25.5,32.99 25.06,33.43 ; 25.5,32.99 25.5,33.87 ; 25.5,32.99 25.5,31.44 ; 25.06,33.43 25.5,33.87 ; 25.06,33.43 C12.1 21.91,33.43 ; 18.39,18.75 19,18.14 ; 19,18.14 19.61,18.75 ; 19,18.14 R12.2 R15.2 ; 25.5,31.44 25.5,30.56 ; 25.5,31.44 25.06,31 ; 25.5,30.56 25.5,26.27 ; 25.5,30.56 25.06,31 ; 25.5,33.87 C5.2 ; C5.2 C6.1 U1.4 U1.2 ; C5.2 30.99,45.25 ; 25.97,18.75 25.03,18.75 ; 25.97,18.75 v1(26.95,18.75) R14.2 28,20.25 28.58,20.83 31.49,20.83 32,21.34 C9.2 ; 25.97,18.75 25.5,19.22 ; 25.03,18.75 R13.2 ; 25.03,18.75 25.5,19.22 ; R11.2 24.98,25.75 ; 24.98,25.75 25.5,25.23 ; 24.98,25.75 25.5,26.27 ; 31.5,44.74 30.99,45.25 ; 31.5,44.74 32,45.25 ; 31.5,44.74 31.5,40.87 31.89,40.47 R8.1 34.08,40.47 34.54,40 34.54,37.34 35.13,36.75 C8.1 C7.2 ; 30.99,45.25 32,45.25 ; 35.85,45.25 37.3,45.25 37.88,44.67 U4.3 ; 35.85,45.25 34.84,45.25 ; 35.85,45.25 35.34,45.76 ; v1(49.04,18.75) R16.2 50,20.16 50.67,20.83 57.66,20.83 58.55,21.72 58.55,33.15 57.88,33.81 H1.2 46.33,33.81 45.25,34.89 R17.2 ; 35.34,47.09 35.34,47.78 ; 35.34,47.09 35.34,45.76 ; 35.34,47.09 35.69,47.43 ; 35.34,47.78 35.69,47.43 ; 32,45.25 C13.1 34.84,45.25 ; 35.69,47.43 36.26,47.43 36.62,47.79 U4.7 ; 34.84,45.25 35.34,45.76 ; 25.5,19.22 25.5,25.23 ; C10.1 v1(44.09,18.75) ; 25.5,26.27 25.5,25.23
  Bottom Layer w0.508: v1(26.95,18.75) v1(44.09,18.75) v1(49.04,18.75)
+5V: length 12.9
  Top Layer w0.508: U1.3 C4.1 C3.2 SW1.3
GND: length 39
  Top Layer w0.254: 30,24.74 C23.1 30,27.48 X2.2 ; 30,24.74 30.23,24.51 ; 30,24.74 29.77,24.51 ; 32.25,33.15 31.75,33.15 ; 32.25,33.15 32.77,33.15 33.15,32.77 33.15,29.91 v1(33.66,29.4) ; 32.25,33.15 32,32.9 ; 31.75,33.15 32,32.9 ; 31.75,33.15 28.57,33.15 28.32,32.89 28.32,24.89 28.7,24.51 30.23,24.51 ; U2.23 42.25,21.46 v1(41.75,20.96) ; 30.23,24.51 32.89,24.51 33.15,24.76 33.15,27.05 v1(33.66,27.56) ; 32,32.9 C22.1 32,29.93 X2.4 ; v1(34.29,27.25) U2.8 ; v1(38.23,33.78) 37.75,33.31 U2.47
VBUS: length 35.8
  Top Layer w0.508: 7.38,27.6 v1(11,27.6) ; SW1.2 C2.1 C1.2 v1(11,32.97) 10.43,32.4 7.38,32.4
  Bottom Layer w0.508: v1(11,32.97) v1(11,27.6)
BOOT0: length 5.1
  Top Layer w0.254: R3.2 40.26,34.42 39.25,33.41 U2.44
BUZZER: length 17.7
  Top Layer w0.254: R9.2 43,41.84 44.05,40.79 v1(44.05,38.99) ; v1(44.05,31.37) U2.36
  Bottom Layer w0.254: v1(44.05,31.37) v1(44.05,38.99)
CC1: length 7.4
  Top Layer w0.254: 7.38,31.25 5.45,31.25 4.75,31.95 R1.1
CC2: length 6.9
  Top Layer w0.254: R2.1 4.75,27.55 5.45,28.25 7.38,28.25
KEY_A: length 27.9
  Top Layer w0.254: 41,7.54 40.71,7.25 ; 41,7.54 41.29,7.25 ; 41,7.54 C18.2 R15.1 41,12.97 40.26,13.72 38.61,13.72 37.75,14.57 U2.14 ; 40.71,7.25 41.29,7.25 ; 40.71,7.25 35.8,7.25 ; 41.29,7.25 44.2,7.25
KEY_B: length 31.3
  Top Layer w0.254: 52,14.54 C19.2 R16.1 ; 52,14.54 52.29,14.25 ; 52,14.54 51.71,14.25 ; 52.29,14.25 55.2,14.25 ; 52.29,14.25 51.71,14.25 ; 51.71,14.25 38.84,14.25 38.25,14.84 U2.15
KEY_DOWN: length 45.8
  Top Layer w0.254: 16.71,7.25 13.8,7.25 ; 16.71,7.25 17.29,7.25 ; 16.71,7.25 17,7.54 ; 17,7.54 C15.2 R12.1 v1(17,13.07) ; 17,7.54 17.29,7.25 ; v1(34.67,19.69) 34.67,25.53 34.89,25.75 U2.11 ; 22.2,7.25 17.29,7.25
  Bottom Layer w0.254: v1(17,13.07) 17,18.91 17.78,19.69 v1(34.67,19.69)
KEY_LEFT: length 49.9
  Top Layer w0.254: v1(35.95,20.32) U2.12 ; 6.29,14.25 11.2,14.25 ; 6.29,14.25 5.71,14.25 ; 6.29,14.25 6,14.54 ; 6,14.54 C16.2 R13.1 v1(6,20.32) ; 6,14.54 5.71,14.25 ; 5.71,14.25 2.8,14.25
  Bottom Layer w0.254: v1(6,20.32) v1(35.95,20.32)
KEY_RIGHT: length 25.5
  Top Layer w0.254: U2.13 37.25,19.34 36.66,18.75 R14.1 C17.2 30,14.54 ; 29.71,14.25 24.8,14.25 ; 29.71,14.25 30,14.54 ; 29.71,14.25 30.29,14.25 ; 30,14.54 30.29,14.25 ; 30.29,14.25 33.2,14.25
KEY_UP: length 44
  Top Layer w0.254: v1(17,27.07) R11.1 C14.2 17,21.54 ; v1(33.66,20.96) 34.16,21.46 34.16,25.65 34.76,26.25 U2.10 ; 17.29,21.25 22.2,21.25 ; 17.29,21.25 17,21.54 ; 17.29,21.25 16.71,21.25 ; 17,21.54 16.71,21.25 ; 13.8,21.25 16.71,21.25
  Bottom Layer w0.254: v1(33.66,20.96) 17.78,20.96 17,21.74 v1(17,27.07)
LCD_BLK: length 77.7
  Top Layer w0.254: U2.21 41.25,22.85 v1(40.75,22.35)
  Bottom Layer w0.254: LCD1.8 49.22,83.89 48.51,83.19 48.51,23.24 47.62,22.35 v1(40.75,22.35)
LCD_CS: length 63.5
  Top Layer w0.254: U2.25 47.52,25.25 48.16,24.62 v1(50.55,24.62)
  Bottom Layer w0.254: v1(50.55,24.62) 50.55,75.56 51.25,76.27 LCD1.5
LCD_DC: length 64.6
  Top Layer w0.254: U2.27 48.17,26.25 48.55,25.87 v1(49.78,25.87)
  Bottom Layer w0.254: LCD1.6 50.62,78.81 49.78,77.98 v1(49.78,25.87)
LCD_MOSI: length 56.3
  Top Layer w0.254: v1(52.07,26.5) 48.81,26.5 48.56,26.75 U2.28
  Bottom Layer w0.254: v1(52.07,26.5) 52.07,70.48 52.78,71.19 LCD1.3
LCD_RES: length 75.9
  Top Layer w0.254: U2.22 41.75,22.22 v1(41.25,21.72)
  Bottom Layer w0.254: LCD1.7 49.98,81.35 49.15,80.52 49.15,22.48 48.39,21.72 v1(41.25,21.72)
LCD_SCK: length 60.2
  Top Layer w0.254: U2.26 47.78,25.75 48.29,25.24 v1(51.31,25.24)
  Bottom Layer w0.254: v1(51.31,25.24) 51.31,72.9 52.14,73.73 LCD1.4
NRST: length 31.6
  Top Layer w0.254: v1(45.25,44.14) R17.1 C24.2 KEY7.2 ; v1(37.08,27.75) U2.7
  Bottom Layer w0.254: v1(37.08,27.75) 44.39,27.75 45.25,28.61 v1(45.25,44.14)
PA6: length 38.8
  Top Layer w0.254: v1(38.99,22.35) 38.99,22.68 38.75,22.91 U2.16 ; R7.2 v1(21.07,39.75)
  Bottom Layer w0.254: v1(21.07,39.75) 20.19,38.87 20.19,23.11 20.96,22.35 v1(38.99,22.35)
PA7: length 41.1
  Top Layer w0.254: U2.17 39.25,22.92 39.75,22.42 v1(39.75,21.72) ; R6.2 v1(18.87,39.75)
  Bottom Layer w0.254: v1(39.75,21.72) 20.96,21.72 19.81,22.86 19.81,38.8 v1(18.87,39.75)
PA9: length 16
  Top Layer w0.254: H1.6 55.34,23.65 54.86,24.13 54.86,27.18 54.29,27.75 U2.30
PA10: length 13.4
  Top Layer w0.254: U2.31 54.55,28.25 H1.5
PA13: length 13
  Top Layer w0.254: H1.4 55.59,29.75 U2.34
PA14: length 15.6
  Top Layer w0.254: H1.3 56.61,31.27 54.74,33.15 43,33.15 42.75,32.89 U2.37
PA15: length 21.1
  Top Layer w0.254: R8.2 U4.1 v1(35.34,40.26) ; U2.38 42.25,33.11 43.31,34.16 v1(43.31,40.26)
  Bottom Layer w0.254: v1(35.34,40.26) v1(43.31,40.26)
PB3: length 26.3
  Top Layer w0.254: U2.39 41.75,33.24 42.67,34.16 42.67,41.28 41.91,42.04 41.91,51.31 41.4,51.82 38.23,51.82 37.88,51.47 U4.6
PB4: length 16.2
  Top Layer w0.254: U2.40 41.25,33.38 42.04,34.16 v1(42.04,40.89) ; v1(36.62,40.89) U4.2
  Bottom Layer w0.254: 36.62,41.02 36.74,40.89 v1(42.04,40.89)
PB5: length 23.1
  Top Layer w0.254: U2.41 40.75,33.64 41.4,34.29 41.4,50.93 41.02,51.31 39.54,51.31 39.16,50.93 U4.5
PC14-OSC32_IN: length 12.3
  Top Layer w0.254: C20.2 32,36.75 ; U2.3 34.77,29.75 34.16,30.35 34.16,35.81 33.23,36.75 X1.2
PC15-OSC32_OUT: length 10.4
  Top Layer w0.254: U2.4 34.63,29.25 33.78,30.1 33.78,33.66 33.19,34.25 X1.1 C21.2
PF0-OSC_IN: length 8.7
  Top Layer w0.254: U2.5 31.18,28.75 X2.1 30.12,32.03 C22.2
PF1-OSC_OUT: length 6.5
  Top Layer w0.254: C23.2 31.88,25.62 X2.3 32.52,28.25 U2.6
UD+: length 9
  Top Layer w0.254: 7.38,30.25 6.5,30.25 6.24,30 6.24,29.53 6.52,29.25 12,29.25 R4.1
UD-: length 8.5
  Top Layer w0.254: 7.38,29.75 8.25,29.75 ; 8.25,29.75 12,29.75 R5.1 ; 8.25,29.75 8.51,30 ; 8.51,30 8.51,30.47 8.23,30.75 7.38,30.75 ; 8.51,30 8.76,29.75
$1N8057: length 3.7
  Top Layer w0.254: 46.65,49.95 46.6,50 R10.1 R9.1
$1N8058: length 5.1
  Top Layer w0.254: BUZZER1.2 Q1.3
$1N15380: length 4.5
  Top Layer w0.254: R4.2 16,29.25 17.74,29.25 18.09,28.9 U3.1
$1N15383: length 6
  Top Layer w0.254: R5.2 16,29.75 18.64,29.75 19.37,29.02 U3.2
$1N15386: length 3.5
  Top Layer w0.254: U3.7 19.37,36.25 R6.1
$1N15389: length 3.5
  Top Layer w0.254: R7.1 20.63,36.31 U3.6

## Copper pours and planes (outline as drawn; the poured copper is in the pictures)
GND on Top Layer: 0,97 0.01,97.26 0.06,97.61 0.15,97.94 0.28,98.27 0.45,98.57 0.65,98.86 0.88,99.12 1.14,99.35 1.43,99.55 1.73,99.72 2.06,99.85 2.39,99.94 2.74,99.99 3,100 57,100 57.26,99.99 57.61,99.94 57.94,99.85 58.27,99.72 58.57,99.55 58.86,99.35 59.12,99.12 59.35,98.86 59.55,98.57 59.72,98.27 59.85,97.94 59.94,97.61 59.99,97.26 60,97 60,3 59.99,2.74 59.94,2.39 59.85,2.06 59.72,1.73 59.55,1.43 59.35,1.14 59.12,0.88 58.86,0.65 58.57,0.45 58.27,0.28 57.94,0.15 57.61,0.06 57.26,0.01 57,0 3,0 2.74,0.01 2.39,0.06 2.06,0.15 1.73,0.28 1.43,0.45 1.14,0.65 0.88,0.88 0.65,1.14 0.45,1.43 0.28,1.73 0.15,2.06 0.06,2.39 0.01,2.74 0,3
GND on Bottom Layer: 0,97 0.01,97.26 0.06,97.61 0.15,97.94 0.28,98.27 0.45,98.57 0.65,98.86 0.88,99.12 1.14,99.35 1.43,99.55 1.73,99.72 2.06,99.85 2.39,99.94 2.74,99.99 3,100 57,100 57.26,99.99 57.61,99.94 57.94,99.85 58.27,99.72 58.57,99.55 58.86,99.35 59.12,99.12 59.35,98.86 59.55,98.57 59.72,98.27 59.85,97.94 59.94,97.61 59.99,97.26 60,97 60,3 59.99,2.74 59.94,2.39 59.85,2.06 59.72,1.73 59.55,1.43 59.35,1.14 59.12,0.88 58.86,0.65 58.57,0.45 58.27,0.28 57.94,0.15 57.61,0.06 57.26,0.01 57,0 3,0 2.74,0.01 2.39,0.06 2.06,0.15 1.73,0.28 1.43,0.45 1.14,0.65 0.88,0.88 0.65,1.14 0.45,1.43 0.28,1.73 0.15,2.06 0.06,2.39 0.01,2.74 0,3

Small or netless copper shapes (teardrops, artwork), in the pictures only: 208 on Top Layer, 16 on Bottom Layer

## Text on the board
Top Silkscreen Layer: LEFT | DOWN | UP | RIGHT | A | SWSDIO | B | SWCLK | 3V3 | GND | RXD | TXD | RST
